# Altium schematic sheet Pour Over 1 Final.SchDoc
size B; SheetNumber: 1; SheetTotal: 1
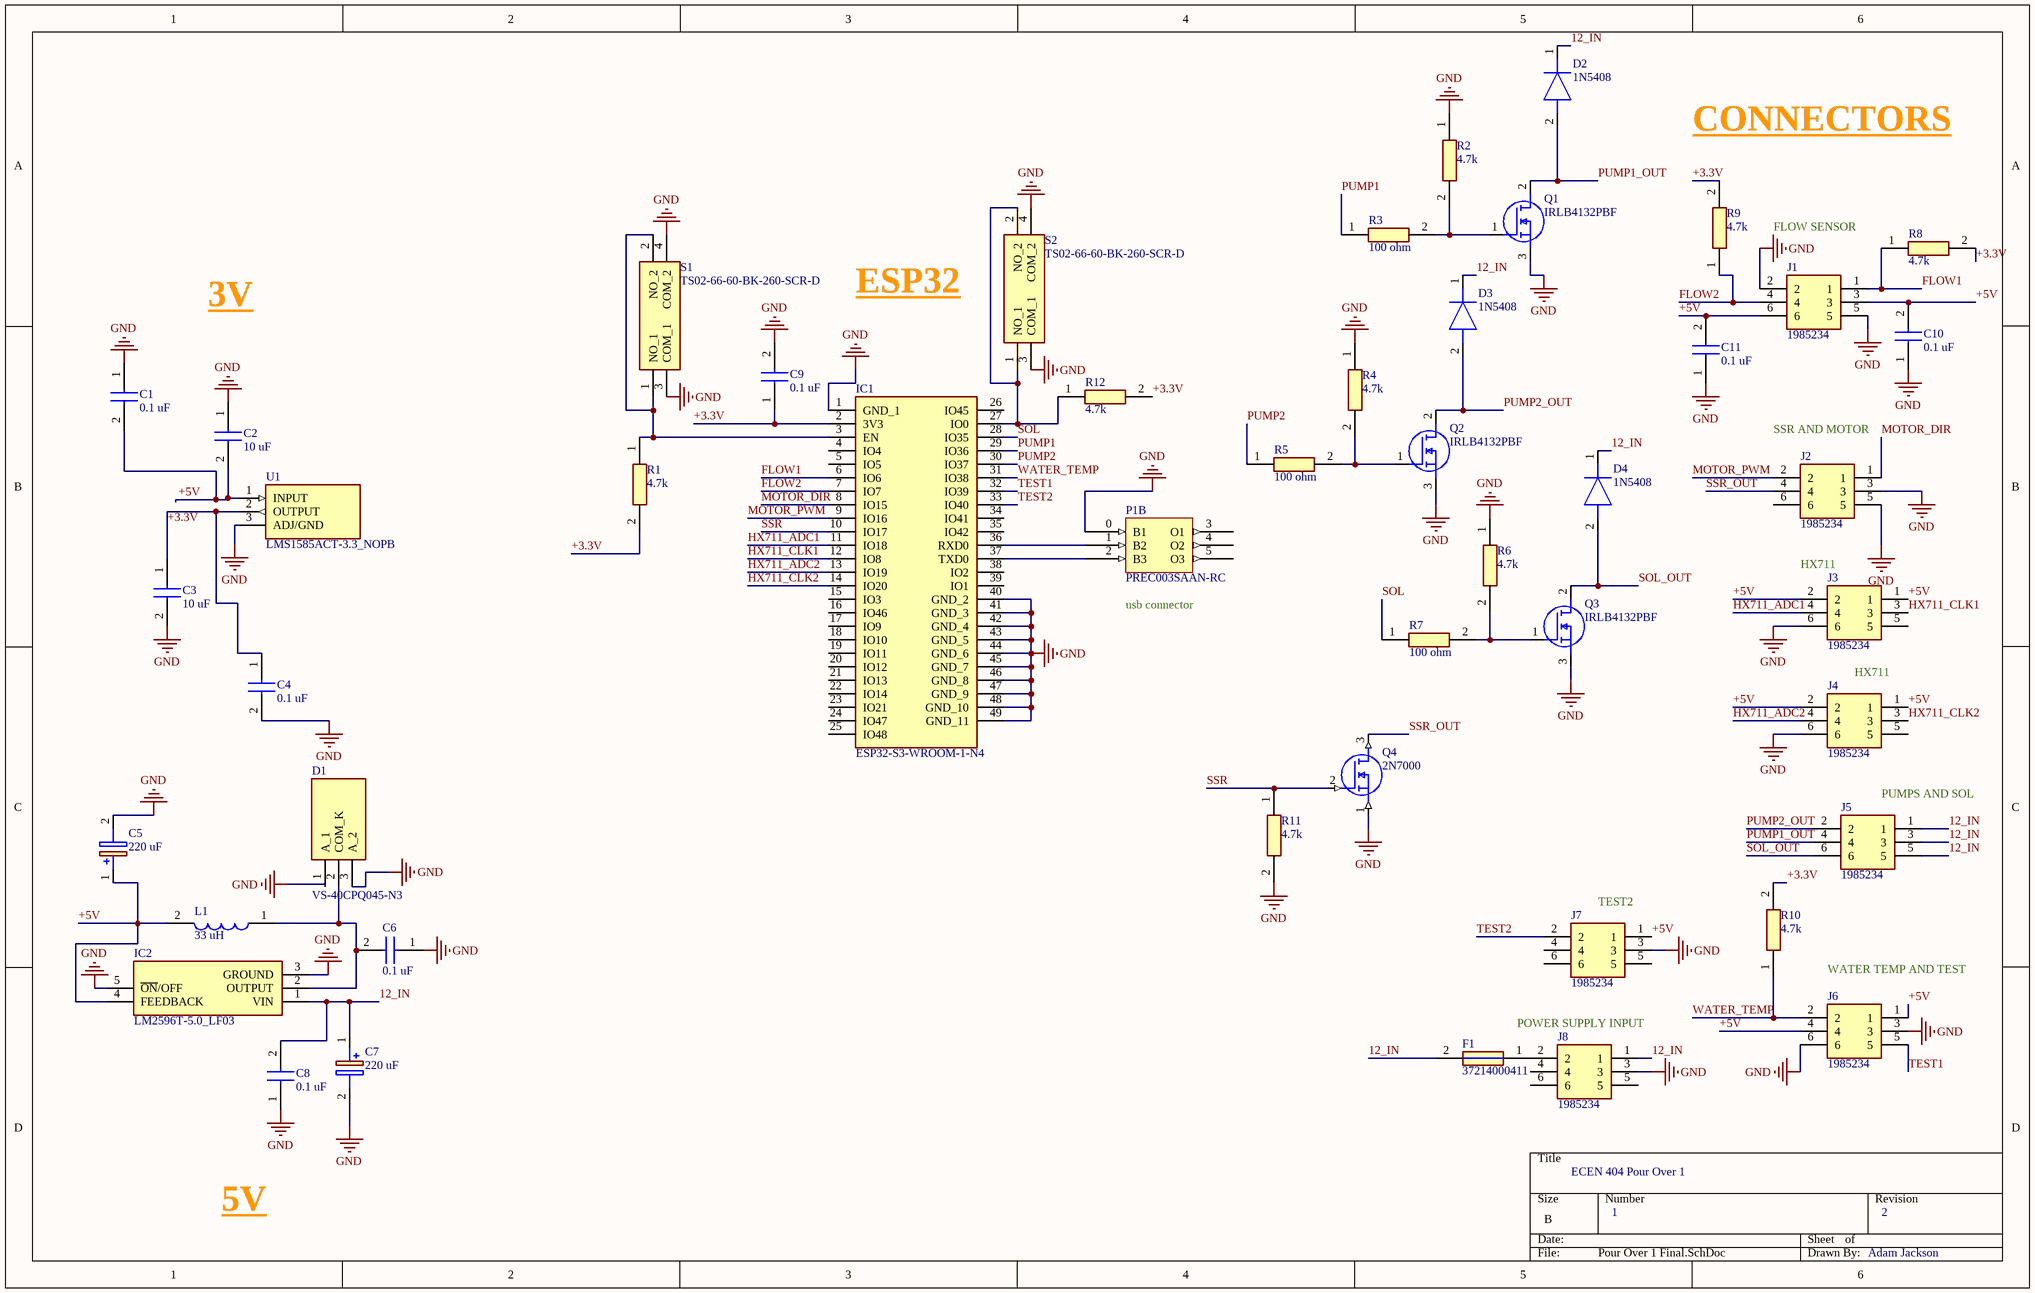
[diagram p0: Pour Over 1 Final.SchDoc]

## Parts
C1  0.1 uF  [K104K10X7RF5TL2]
C2  10 uF  [FG16]
C3  10 uF  [FG16]
C4  0.1 uF  [K104K10X7RF5TL2]
C5  220 uF  [EEHZT1E331UP]
C6  0.1 uF  [K104K10X7RF5TL2]
C7  220 uF  [EEHZT1E331UP]
C8  0.1 uF  [K104K10X7RF5TL2]
C9  0.1 uF  [K104K10X7RF5TL2]
C10  0.1 uF  [K104K10X7RF5TL2]
C11  0.1 uF  [K104K10X7RF5TL2]
D1  VS-40CPQ045-N3  [TO546P531X1558X2499-3P]
D2  1N5408  [DIOAD3020W130L900D530]
D3  1N5408  [DIOAD3020W130L900D530]
D4  1N5408  [DIOAD3020W130L900D530]
F1  37214000411  [37214000411]
IC1  ESP32-S3-WROOM-1-N4  [ESP32S3WROOM1N4]
IC2  LM2596T-5.0_LF03  [TO170P470X1028X2142-5P]
J1  1985234  [1985234]
J2  1985234  [1985234]
J3  1985234  [1985234]
J4  1985234  [1985234]
J5  1985234  [1985234]
J6  1985234  [1985234]
J7  1985234  [1985234]
J8  1985234  [1985234]
L1  33 uH  [INDPM8680X400N]
P1  PREC003SAAN-RC  [CONNECTOR]  (part B of 2)
Q1  IRLB4132PBF  [TO254P483X1016X1994-3P]
Q2  IRLB4132PBF  [TO254P483X1016X1994-3P]
Q3  IRLB4132PBF  [TO254P483X1016X1994-3P]
Q4  2N7000  [TO-92_(TO-226)]
R1  4.7k  [RESAD1526W69L610D229]
R2  4.7k  [RESAD1526W69L610D229]
R3  100 ohm  [RESAD1590W70L630D240]
R4  4.7k  [RESAD1526W69L610D229]
R5  100 ohm  [RESAD1590W70L630D240]
R6  4.7k  [RESAD1526W69L610D229]
R7  100 ohm  [RESAD1590W70L630D240]
R8  4.7k  [RESAD1526W69L610D229]
R9  4.7k  [RESAD1526W69L610D229]
R10  4.7k  [RESAD1526W69L610D229]
R11  4.7k  [RESAD1526W69L610D229]
R12  4.7k  [RESAD1526W69L610D229]
S1  TS02-66-60-BK-260-SCR-D  [TS026660BK260SCRD]
S2  TS02-66-60-BK-260-SCR-D  [TS026660BK260SCRD]
U1  LMS1585ACT-3.3_NOPB  [TO254P470X1028X1955-3P]

## Nets
GND: C1.1 C2.1 C3.2 C4.2 C5.2(-) C6.1 C7.2(-) C8.1 C9.2 C10.1 C11.1 D1.1(A_1) D1.3(A_2) IC1.1(GND_1) IC1.40(GND_2) IC1.41(GND_3) IC1.42(GND_4) IC1.43(GND_5) IC1.44(GND_6) IC1.45(GND_7) IC1.46(GND_8) IC1.47(GND_9) IC1.48(GND_10) IC1.49(GND_11) IC2.3(GROUND) IC2.5(~{ON}/OFF) J1.2 J1.5 J2.3 J2.5 J3.6 J4.6 J6.3 J6.6 J7.3 J8.3 P1.0(B1) Q1.3(S) Q2.3(S) Q3.3(S) Q4.1(S) R2.1 R4.1 R6.1 R11.2 S1.3(COM_1) S1.4(COM_2) S2.3(COM_1) S2.4(COM_2) U1.3(ADJ/GND)
12_IN: C7.1(+) C8.2 D2.1(K) D3.1(K) D4.1(K) F1.2 IC2.1(VIN) J5.1 J5.3 J5.5 J8.1
+3.3V: C3.1 C4.1 C9.1 IC1.2(3V3) R1.2 R8.2 R9.2 R10.2 R12.2 U1.2(OUTPUT)
+5V: C1.2 C2.2 C5.1(+) C10.2 C11.2 IC2.4(FEEDBACK) J1.3 J1.6 J3.1 J3.2 J4.1 J4.2 J6.1 J6.4 J7.1 L1.2 U1.1(INPUT)
FLOW1: IC1.6(IO6) J1.1 R8.1
FLOW2: IC1.7(IO7) J1.4 R9.1
HX711_ADC1: IC1.11(IO18) J3.4
HX711_ADC2: IC1.13(IO19) J4.4
HX711_CLK1: IC1.12(IO8) J3.3
HX711_CLK2: IC1.14(IO20) J4.3
MOTOR_DIR: IC1.8(IO15) J2.1
MOTOR_PWM: IC1.9(IO16) J2.2
PUMP1: IC1.29(IO36) R3.1
PUMP1_OUT: D2.2(A) J5.4 Q1.2(D)
PUMP2: IC1.30(IO37) R5.1
PUMP2_OUT: D3.2(A) J5.2 Q2.2(D)
SOL: IC1.28(IO35) R7.1
SOL_OUT: D4.2(A) J5.6 Q3.2(D)
SSR: IC1.10(IO17) Q4.2(G) R11.1
SSR_OUT: J2.4 Q4.3(D)
TEST1: IC1.32(IO39) J6.5
TEST2: IC1.33(IO40) J7.2
WATER_TEMP: IC1.31(IO38) J6.2 R10.1
NetC6_2: C6.2 D1.2(COM_K) IC2.2(OUTPUT) L1.1
NetF1_1: F1.1 J8.2
NetIC1_3: IC1.3(EN) R1.1 S1.1(NO_1) S1.2(NO_2)
NetIC1_27: IC1.27(IO0) R12.1 S2.1(NO_1) S2.2(NO_2)
NetIC1_36: IC1.36(RXD0) P1.1(B2)
NetIC1_37: IC1.37(TXD0) P1.2(B3)
NetQ1_1: Q1.1(G) R2.2 R3.2
NetQ2_1: Q2.1(G) R4.2 R5.2
NetQ3_1: Q3.1(G) R6.2 R7.2

Not connected (* = marked no-connect by the designer): IC1 4(IO4) 5(IO5) 15(IO3) 16(IO46) 17(IO9) 18(IO10) 19(IO11) 20(IO12) 21(IO13) 22(IO14) 23(IO21) 24(IO47) 25(IO48) 26(IO45) 34(IO41) 35(IO42) 38(IO2) 39(IO1); J2 6; J3 5; J4 5; J7 4 5 6; J8 4 5 6; P1 3(O1) 4(O2) 5(O3)

## Notes on the sheet
- CONNECTORS
- FLOW SENSOR
- ESP32
- 3V
- (near J2) SSR AND MOTOR
- (near J3) HX711
- (near P1) usb connector
- HX711
- (near J5) PUMPS AND SOL
- (near J7) TEST2
- WATER TEMP AND TEST
- POWER SUPPLY INPUT
- ECEN 404 Pour Over 1
- 5V
- 1
- 2
- Adam Jackson

## Library data of the parts
C1 C4 C6 C8-C11 = K104K10X7RF5TL2: Capacitor; Manufacturer_Name: Vishay; Datasheet Link: https://www.vishay.com/docs/45171/kseries.pdf; Height: 5.2mm; Manufacturer_Part_Number: K104K10X7RF5TL2; Mouser Part Number: 594-K104K10X7RF5TL2; Mouser Price/Stock: https://www.mouser.co.uk/ProductDetail/Vishay-BC-Components/K104K10X7RF5TL2?qs=B4Lc6Tv24tbCh1UvC16VNg%3D%3D; Arrow Part Number: K104K10X7RF5TL2; Arrow Price/Stock: https://www.arrow.com/en/products/k104k10x7rf5tl2/vishay?region=nac
C2 C3 = FG16X7R1E106KRT06: Capacitor; Manufacturer_Name: TDK; Datasheet Link: https://product.tdk.com/system/files/dam/doc/product/capacitor/ceramic/lead-mlcc/catalog/leadmlcc_halogenfree_fg_en.pdf; Height: 5.5mm; Manufacturer_Part_Number: FG16X7R1E106KRT06; Mouser Part Number: 810-FG16X7R1E106KRT6; Mouser Price/Stock: https://www.mouser.co.uk/ProductDetail/TDK/FG16X7R1E106KRT06?qs=qf2ddTMq67V1hYQaidv4ew%3D%3D; Arrow Part Number: FG16X7R1E106KRT06; Arrow Price/Stock: https://www.arrow.com/en/products/fg16x7r1e106krt06/tdk
C5 C7 = EEE-TP1C221AP: Capacitor Polarised; Manufacturer_Name: Panasonic; Datasheet Link: http://industrial.panasonic.com/cdbs/www-data/pdf/RDE0000/ABA0000C1196.pdf; Height: 10.8mm; Manufacturer_Part_Number: EEE-TP1C221AP; Mouser Part Number: 667-EEE-TP1C221AP; Mouser Price/Stock: https://www.mouser.com/Search/Refine.aspx?Keyword=667-EEE-TP1C221AP
D1 = VS-40CPQ045-N3: Diode; Manufacturer_Name: Vishay; Datasheet Link: https://www.vishay.com/docs/96456/vs-40cpq-n3series.pdf; Height: 5.31mm; Manufacturer_Part_Number: VS-40CPQ045-N3; Mouser Part Number: 78-VS-40CPQ045-N3; Mouser Price/Stock: https://www.mouser.com/Search/Refine.aspx?Keyword=78-VS-40CPQ045-N3
D2-D4 = 1N5408: Diode; Manufacturer_Name: HY Electronic; Datasheet Link: http://uk.rs-online.com/web/p/products/9033315; Manufacturer_Part_Number: 1N5408
F1 = 37214000411: Fuse; Manufacturer_Name: LITTELFUSE; Datasheet Link: https://componentsearchengine.com/Datasheets/1/37214000411.pdf; Height: 8mm; Manufacturer_Part_Number: 37214000411; Mouser Part Number: 576-37214000411; Mouser Price/Stock: https://www.mouser.com/Search/Refine.aspx?Keyword=576-37214000411; Arrow Part Number: 37214000411; Arrow Price/Stock: https://www.arrow.com/en/products/37214000411/littelfuse.html?utm_currency=USD&region=europe
IC1 = ESP32-S3-WROOM-1-N4: Integrated Circuit; Manufacturer_Name: Espressif Systems; Datasheet Link: https://www.espressif.com/sites/default/files/documentation/esp32-s3-wroom-1_wroom-1u_datasheet_en.pdf; Height: 3.25mm; Manufacturer_Part_Number: ESP32-S3-WROOM-1-N4; Mouser Part Number: 356-ESP32-S3WROOM1N4; Mouser Price/Stock: https://www.mouser.co.uk/ProductDetail/Espressif-Systems/ESP32-S3-WROOM-1-N4?qs=Li%252BoUPsLEnsO%2FkiJOUK0FQ%3D%3D
IC2 = LM2596T-5.0_LF03: Integrated Circuit; Manufacturer_Name: Texas Instruments; Manufacturer_Part_Number: LM2596T-5.0/LF03; Datasheet Link: https://www.ti.com/lit/ds/symlink/lm2596.pdf?ts=1607069798907&ref_url=https%253A%252F%252Fwww.ti.com%252Fstore%252Fti%252Fen%252Fp%252Fproduct%252F%253Fp%253DLM2596T-5.0%252FLF03%2526keyMatch%253DLM2596T-5.0%252FLF03%2526tisearch%253DSearch-EN-everything%; Height: 4.7mm; Mouser Part Number: 926-LM2596T-50/LF03; Mouser Price/Stock: https://www.mouser.co.uk/ProductDetail/Texas-Instruments/LM2596T-5.0-LF03?qs=X1J7HmVL2ZG6KM98hB9zGA%3D%3D; Arrow Part Number: LM2596T-5.0/LF03; Arrow Price/Stock: https://www.arrow.com/en/products/lm2596t-5.0lf03/texas-instruments?utm_currency=USD&region=nac
J1-J8 = 1985234: Connector; Manufacturer_Name: Phoenix Contact; Datasheet Link: https://www.phoenixcontact.com/en-us/products/printed-circuit-board-terminal-ptsa-15-6-35-z-1985234?type=pdf; Height: 13.1mm; Manufacturer_Part_Number: 1985234; Mouser Part Number: 651-1985234; Mouser Price/Stock: https://www.mouser.co.uk/ProductDetail/Phoenix-Contact/1985234?qs=A%2FKWGUWTCZgjCof%252B1YY92w%3D%3D; Arrow Part Number: 1985234; Arrow Price/Stock: https://www.arrow.com/en/products/1985234/phoenix-contact.html?utm_currency=USD&region=nac
L1 = F1F2-0804-330M: Inductor; Manufacturer_Name: Bel; Datasheet Link: https://www.mouser.in/datasheet/3/191/1/ds-ST-F1F2-0804-series.pdf; Height: 4mm; Manufacturer_Part_Number: F1F2-0804-330M
P1 = PREC003SAAN-RC: ESP32 USB Connector
Q1-Q3 = IRLB4132PBF: MOSFET (N-Channel); Manufacturer_Name: Infineon; Datasheet Link: https://4donline.ihs.com/images/VipMasterIC/IC/INFN/INFN-S-A0008993592/INFN-S-A0008993592-1.pdf?hkey=6D3A4C79FDBF58556ACFDE234799DDF0; Height: 4.83mm; Manufacturer_Part_Number: IRLB4132PBF; Mouser Part Number: 942-IRLB4132PBF; Mouser Price/Stock: https://www.mouser.co.uk/ProductDetail/Infineon-Technologies/IRLB4132PBF?qs=7jf4hlN%252BSJAw3gjmC05T%2Fw%3D%3D; Arrow Part Number: IRLB4132PBF; Arrow Price/Stock: https://www.arrow.com/en/products/irlb4132pbf/infineon-technologies-ag.html?utm_currency=USD&region=nac
Q4 = 2N7000: MOSFET (N-Channel); Manufacturer_Name: onsemi; Datasheet Link: https://www.onsemi.com/pub/Collateral/NDS7002A-D.PDF; Height: 5.33mm; Manufacturer_Part_Number: 2N7000; Mouser Part Number: 512-2N7000; Mouser Price/Stock: https://www.mouser.co.uk/ProductDetail/onsemi-Fairchild/2N7000?qs=FOlmdCx%252BAA2o%2FKZOTk%2F3hg%3D%3D; Arrow Part Number: 2N7000; Arrow Price/Stock: https://www.arrow.com/en/products/2n7000/on-semiconductor.html?utm_currency=USD&region=europe
R1 R2 R4 R6 R8-R12 = RN55E4701BRE6: Resistor; Manufacturer_Name: Vishay; Datasheet Link: https://www.vishay.com/docs/31027/cmfmil.pdf; Manufacturer_Part_Number: RN55E4701BRE6
R3 R5 R7 = MFP-25BRD52-100R: Resistor; Manufacturer_Name: Yageo Group; Datasheet Link: https://www.yageo.com/upload/media/product/productsearch/datasheet/lr/YAGEO%20MFP_datasheet_2021v0.pdf; Manufacturer_Part_Number: MFP-25BRD52-100R; Mouser Part Number: 603-MFP-25BRD52-100R; Mouser Price/Stock: https://www.mouser.co.uk/ProductDetail/YAGEO/MFP-25BRD52-100R?qs=lfEcNZWccVkSKxBYlhOoug%3D%3D; Arrow Part Number: MFP-25BRD52-100R; Arrow Price/Stock: https://www.arrow.com/en/products/mfp-25brd52-100r/yageo
S1 S2 = TS02-66-60-BK-260-SCR-D: Switch; Manufacturer_Name: Same Sky; Datasheet Link: https://www.sameskydevices.com/product/resource/ts02.pdf; Height: 6.2mm; Manufacturer_Part_Number: TS02-66-60-BK-260-SCR-D; Mouser Part Number: 179-TS026660BK260SCR; Mouser Price/Stock: https://www.mouser.co.uk/ProductDetail/CUI-Devices/TS02-66-60-BK-260-SCR-D?qs=A6eO%252BMLsxmSDYX3TQ5KZSA%3D%3D; Arrow Part Number: TS02-66-60-BK-260-SCR-D; Arrow Price/Stock: https://www.arrow.com/en/products/ts02-66-60-bk-260-scr-d/cui-devices?region=nac
U1 = LMS1585ACT-3.3_NOPB: Undefined or Miscellaneous; Manufacturer_Name: Texas Instruments; Manufacturer_Part_Number: LMS1585ACT-3.3/NOPB; Datasheet Link: http://www.ti.com/lit/gpn/lms1585a; Height: 4.7mm; Mouser Part Number: 926-LMS1585ACT33NOPB; Mouser Price/Stock: https://www.mouser.co.uk/ProductDetail/Texas-Instruments/LMS1585ACT-3.3-NOPB?qs=7lkVKPoqpbYfezQINhjreg%3D%3D; Arrow Part Number: LMS1585ACT-3.3/NOPB; Arrow Price/Stock: https://www.arrow.com/en/products/lms1585act-3.3nopb/texas-instruments?region=nac